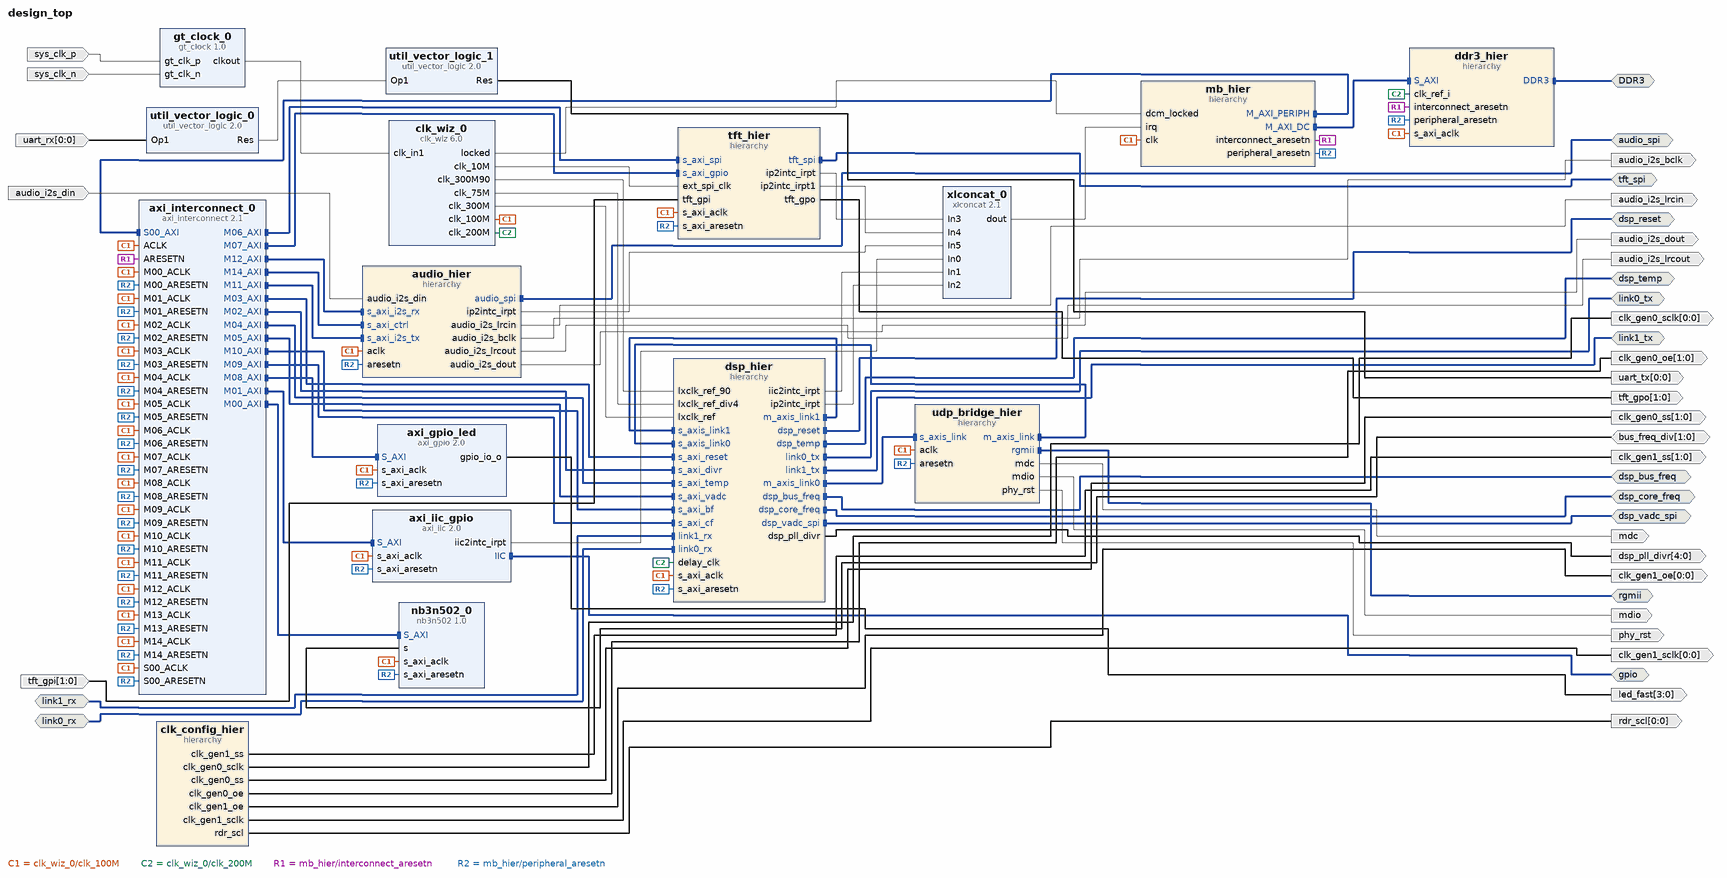
[diagram p0: block diagram of the top level]
# Vivado block design design_top, xc7a200tffg1156-2, Vivado 2018.3
create_bd_design design_top

create_bd_intf_port -mode Master -vlnv xilinx.com:interface:ddrx_rtl:1.0 DDR3
create_bd_intf_port -mode Master -vlnv xilinx.com:interface:iic_rtl:1.0 gpio
create_bd_intf_port -mode Master -vlnv xilinx.com:interface:iic_rtl:1.0 dsp_temp
create_bd_intf_port -mode Master -vlnv xilinx.com:interface:spi_rtl:1.0 tft_spi
create_bd_intf_port -mode Master -vlnv xilinx.com:interface:spi_rtl:1.0 dsp_vadc_spi
create_bd_intf_port -mode Master -vlnv xilinx.com:interface:gpio_rtl:1.0 dsp_reset
create_bd_intf_port -mode Slave -vlnv milandr.ru:interface:link_io_rtl:1.0 link0_rx
create_bd_intf_port -mode Slave -vlnv milandr.ru:interface:link_io_rtl:1.0 link1_rx
create_bd_intf_port -mode Master -vlnv milandr.ru:interface:link_io_rtl:1.0 link0_tx
create_bd_intf_port -mode Master -vlnv milandr.ru:interface:link_io_rtl:1.0 link1_tx
create_bd_intf_port -mode Master -vlnv xilinx.com:interface:gpio_rtl:1.0 dsp_core_freq
create_bd_intf_port -mode Master -vlnv xilinx.com:interface:gpio_rtl:1.0 dsp_bus_freq
create_bd_intf_port -mode Master -vlnv xilinx.com:interface:rgmii_rtl:1.0 rgmii
create_bd_intf_port -mode Master -vlnv xilinx.com:interface:spi_rtl:1.0 audio_spi
create_bd_port -dir O -from 3 -to 0 led_fast
create_bd_port -dir I -type clk sys_clk_p
create_bd_port -dir I -type clk sys_clk_n
create_bd_port -dir O -from 1 -to 0 clk_gen1_ss
create_bd_port -dir O -from 0 -to 0 clk_gen0_sclk
create_bd_port -dir O -from 1 -to 0 clk_gen0_ss
create_bd_port -dir O -from 1 -to 0 clk_gen0_oe
create_bd_port -dir O -from 0 -to 0 clk_gen1_oe
create_bd_port -dir O -from 0 -to 0 clk_gen1_sclk
create_bd_port -dir O -from 0 -to 0 rdr_scl
create_bd_port -dir IO -from 1 -to 0 bus_freq_div
create_bd_port -dir O -from 4 -to 0 dsp_pll_divr
create_bd_port -dir I -from 0 -to 0 uart_rx
create_bd_port -dir O -from 0 -to 0 uart_tx
create_bd_port -dir I -from 1 -to 0 tft_gpi
create_bd_port -dir O -from 1 -to 0 tft_gpo
create_bd_port -dir O mdc
create_bd_port -dir O mdio
create_bd_port -dir O -type rst phy_rst
create_bd_port -dir O audio_i2s_lrcin
create_bd_port -dir O audio_i2s_lrcout
create_bd_port -dir O audio_i2s_bclk
create_bd_port -dir O audio_i2s_dout
create_bd_port -dir I audio_i2s_din

create_bd_cell -type ip -vlnv xilinx.com:ip:clk_wiz:6.0 clk_wiz_0
set_property -dict [list \
  CONFIG.CLKOUT1_JITTER 115.831 \
  CONFIG.CLKOUT1_PHASE_ERROR 87.180 \
  CONFIG.CLKOUT2_JITTER 102.086 \
  CONFIG.CLKOUT2_PHASE_ERROR 87.180 \
  CONFIG.CLKOUT2_REQUESTED_OUT_FREQ 200.000 \
  CONFIG.CLKOUT2_USED true \
  CONFIG.CLKOUT3_JITTER 94.862 \
  CONFIG.CLKOUT3_PHASE_ERROR 87.180 \
  CONFIG.CLKOUT3_REQUESTED_OUT_FREQ 300.000 \
  CONFIG.CLKOUT3_USED true \
  CONFIG.CLKOUT4_JITTER 94.862 \
  CONFIG.CLKOUT4_PHASE_ERROR 87.180 \
  CONFIG.CLKOUT4_REQUESTED_OUT_FREQ 300.000 \
  CONFIG.CLKOUT4_REQUESTED_PHASE -90 \
  CONFIG.CLKOUT4_USED true \
  CONFIG.CLKOUT5_JITTER 122.158 \
  CONFIG.CLKOUT5_PHASE_ERROR 87.180 \
  CONFIG.CLKOUT5_REQUESTED_OUT_FREQ 75.000 \
  CONFIG.CLKOUT5_USED true \
  CONFIG.CLKOUT6_JITTER 188.586 \
  CONFIG.CLKOUT6_PHASE_ERROR 87.180 \
  CONFIG.CLKOUT6_REQUESTED_OUT_FREQ 10.000 \
  CONFIG.CLKOUT6_USED true \
  CONFIG.CLKOUT7_JITTER 115.831 \
  CONFIG.CLKOUT7_PHASE_ERROR 87.180 \
  CONFIG.CLKOUT7_REQUESTED_OUT_FREQ 10 \
  CONFIG.CLKOUT7_USED false \
  CONFIG.CLK_OUT1_PORT clk_100M \
  CONFIG.CLK_OUT2_PORT clk_200M \
  CONFIG.CLK_OUT3_PORT clk_300M \
  CONFIG.CLK_OUT4_PORT clk_300M90 \
  CONFIG.CLK_OUT5_PORT clk_75M \
  CONFIG.CLK_OUT6_PORT clk_10M \
  CONFIG.CLK_OUT7_PORT clk_10M \
  CONFIG.MMCM_CLKFBOUT_MULT_F 12.000 \
  CONFIG.MMCM_CLKOUT0_DIVIDE_F 12.000 \
  CONFIG.MMCM_CLKOUT1_DIVIDE 6 \
  CONFIG.MMCM_CLKOUT2_DIVIDE 4 \
  CONFIG.MMCM_CLKOUT3_DIVIDE 4 \
  CONFIG.MMCM_CLKOUT3_PHASE -90.000 \
  CONFIG.MMCM_CLKOUT4_DIVIDE 16 \
  CONFIG.MMCM_CLKOUT5_DIVIDE 120 \
  CONFIG.MMCM_CLKOUT6_DIVIDE 1 \
  CONFIG.MMCM_DIVCLK_DIVIDE 1 \
  CONFIG.NUM_OUT_CLKS 6 \
  CONFIG.PRIM_IN_FREQ 100.000 \
  CONFIG.PRIM_SOURCE Global_buffer \
  CONFIG.USE_RESET false \
] [get_bd_cells clk_wiz_0]
create_bd_cell -type hier ddr3_hier
create_bd_cell -type hier mb_hier
create_bd_cell -type ip -vlnv xilinx.com:ip:axi_interconnect:2.1 axi_interconnect_0
set_property -dict {CONFIG.NUM_MI 15} [get_bd_cells axi_interconnect_0]
create_bd_cell -type ip -vlnv xilinx.com:ip:axi_iic:2.0 axi_iic_gpio
create_bd_cell -type ip -vlnv xilinx.com:ip:xlconcat:2.1 xlconcat_0
set_property -dict {CONFIG.NUM_PORTS 6} [get_bd_cells xlconcat_0]
create_bd_cell -type ip -vlnv xilinx.com:ip:util_vector_logic:2.0 util_vector_logic_0
set_property -dict {CONFIG.C_OPERATION not CONFIG.C_SIZE 1} [get_bd_cells util_vector_logic_0]
create_bd_cell -type ip -vlnv xilinx.com:ip:util_vector_logic:2.0 util_vector_logic_1
set_property -dict {CONFIG.C_OPERATION not CONFIG.C_SIZE 1} [get_bd_cells util_vector_logic_1]
create_bd_cell -type ip -vlnv xilinx.com:ip:axi_gpio:2.0 axi_gpio_led
set_property -dict {CONFIG.C_ALL_OUTPUTS 1 CONFIG.C_GPIO_WIDTH 4} [get_bd_cells axi_gpio_led]
create_bd_cell -type hier clk_config_hier
create_bd_cell -type hier dsp_hier
create_bd_cell -type hier tft_hier
create_bd_cell -type hier udp_bridge_hier
create_bd_cell -type hier audio_hier
create_bd_cell -type ip -vlnv milandr.ru:ip:gt_clock:1.0 gt_clock_0
create_bd_cell -type ip -vlnv milandr.ru:ip:nb3n502:1.0 nb3n502_0

# ---- hierarchy /ddr3_hier ----
current_bd_instance /ddr3_hier
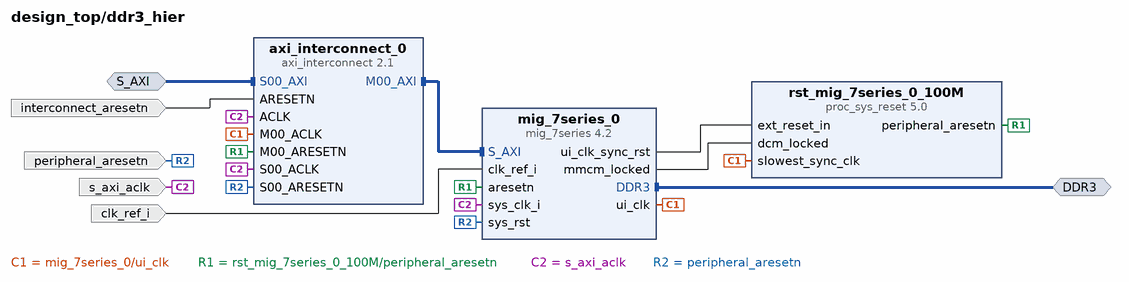
[diagram p1: block diagram inside /ddr3_hier]
create_bd_intf_pin -mode Master -vlnv xilinx.com:interface:ddrx_rtl:1.0 DDR3
create_bd_intf_pin -mode Slave -vlnv xilinx.com:interface:aximm_rtl:1.0 S_AXI
create_bd_pin -dir I -type rst interconnect_aresetn
create_bd_pin -dir I -type clk clk_ref_i
create_bd_pin -dir I -type clk s_axi_aclk
create_bd_pin -dir I -type rst peripheral_aresetn

create_bd_cell -type ip -vlnv xilinx.com:ip:mig_7series:4.2 mig_7series_0
set_property -dict [list \
  CONFIG.BOARD_MIG_PARAM Custom \
  CONFIG.RESET_BOARD_INTERFACE Custom \
  CONFIG.XML_INPUT_FILE mig_a.prj \
] [get_bd_cells mig_7series_0]
create_bd_cell -type ip -vlnv xilinx.com:ip:proc_sys_reset:5.0 rst_mig_7series_0_100M
create_bd_cell -type ip -vlnv xilinx.com:ip:axi_interconnect:2.1 axi_interconnect_0
set_property -dict {CONFIG.NUM_MI 1 CONFIG.NUM_SI 1} [get_bd_cells axi_interconnect_0]

# ---- hierarchy /mb_hier ----
current_bd_instance /mb_hier
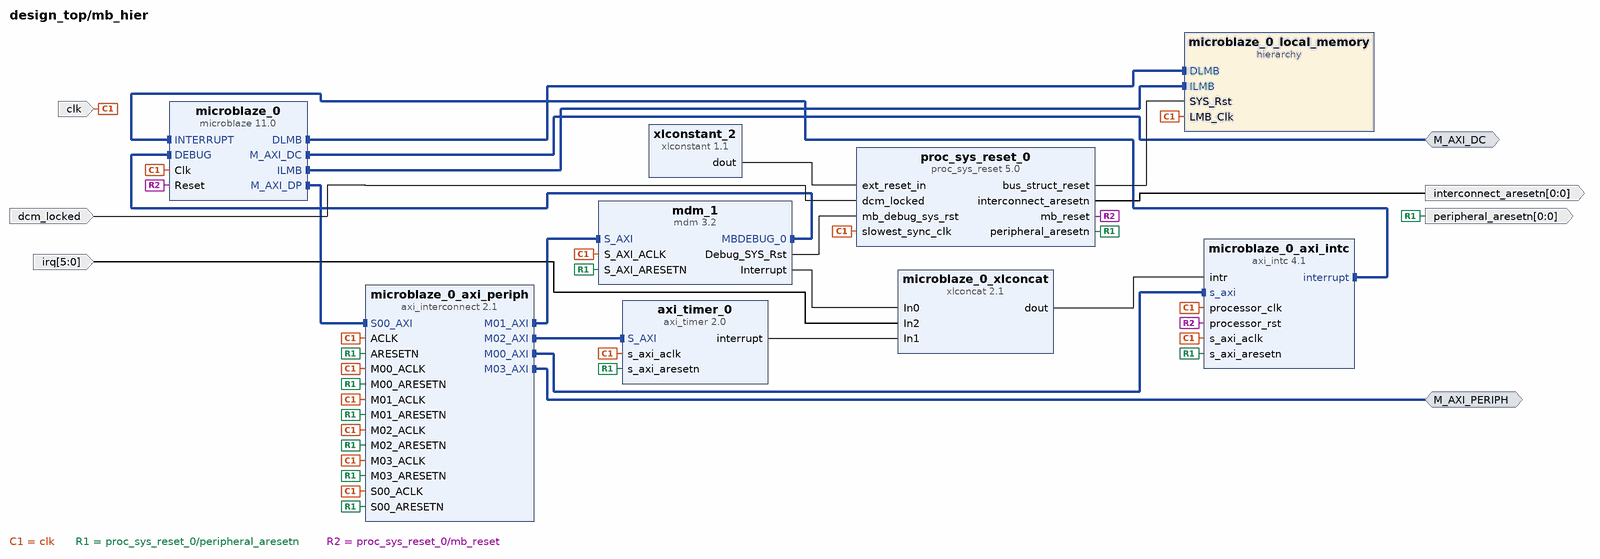
[diagram p2: block diagram inside /mb_hier]
create_bd_intf_pin -mode Master -vlnv xilinx.com:interface:aximm_rtl:1.0 M_AXI_DC
create_bd_intf_pin -mode Master -vlnv xilinx.com:interface:aximm_rtl:1.0 M_AXI_PERIPH
create_bd_pin -dir I -type clk clk
create_bd_pin -dir I dcm_locked
create_bd_pin -dir O -from 0 -to 0 -type rst interconnect_aresetn
create_bd_pin -dir O -from 0 -to 0 -type rst peripheral_aresetn
create_bd_pin -dir I -from 5 -to 0 irq

create_bd_cell -type ip -vlnv xilinx.com:ip:mdm:3.2 mdm_1
set_property -dict {CONFIG.C_ADDR_SIZE 32 CONFIG.C_M_AXI_ADDR_WIDTH 32 CONFIG.C_USE_UART 1} [get_bd_cells mdm_1]
create_bd_cell -type ip -vlnv xilinx.com:ip:axi_intc:4.1 microblaze_0_axi_intc
set_property -dict {CONFIG.C_HAS_FAST 1} [get_bd_cells microblaze_0_axi_intc]
create_bd_cell -type ip -vlnv xilinx.com:ip:axi_timer:2.0 axi_timer_0
create_bd_cell -type ip -vlnv xilinx.com:ip:xlconcat:2.1 microblaze_0_xlconcat
set_property -dict {CONFIG.NUM_PORTS 3} [get_bd_cells microblaze_0_xlconcat]
create_bd_cell -type ip -vlnv xilinx.com:ip:microblaze:11.0 microblaze_0
set_property -dict [list \
  CONFIG.C_ADDR_TAG_BITS 0 \
  CONFIG.C_DCACHE_ADDR_TAG 16 \
  CONFIG.C_DCACHE_FORCE_TAG_LUTRAM 0 \
  CONFIG.C_DCACHE_USE_WRITEBACK 0 \
  CONFIG.C_DEBUG_ENABLED 1 \
  CONFIG.C_D_AXI 1 \
  CONFIG.C_D_LMB 1 \
  CONFIG.C_I_LMB 1 \
  CONFIG.C_USE_BARREL 1 \
  CONFIG.C_USE_DCACHE 1 \
  CONFIG.C_USE_DIV 1 \
  CONFIG.C_USE_FPU 1 \
  CONFIG.C_USE_HW_MUL 1 \
  CONFIG.C_USE_ICACHE 0 \
  CONFIG.C_USE_MSR_INSTR 1 \
  CONFIG.C_USE_PCMP_INSTR 1 \
  CONFIG.C_USE_REORDER_INSTR 1 \
] [get_bd_cells microblaze_0]
create_bd_cell -type hier microblaze_0_local_memory
create_bd_cell -type ip -vlnv xilinx.com:ip:axi_interconnect:2.1 microblaze_0_axi_periph
set_property -dict {CONFIG.NUM_MI 4} [get_bd_cells microblaze_0_axi_periph]
create_bd_cell -type ip -vlnv xilinx.com:ip:proc_sys_reset:5.0 proc_sys_reset_0
create_bd_cell -type ip -vlnv xilinx.com:ip:xlconstant:1.1 xlconstant_2

# ---- hierarchy /mb_hier/microblaze_0_local_memory ----
current_bd_instance /mb_hier/microblaze_0_local_memory
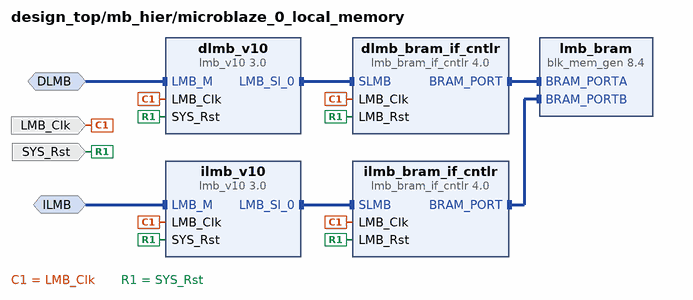
[diagram p3: block diagram inside /mb_hier/microblaze_0_local_memory]
create_bd_intf_pin -mode MirroredMaster -vlnv xilinx.com:interface:lmb_rtl:1.0 DLMB
create_bd_intf_pin -mode MirroredMaster -vlnv xilinx.com:interface:lmb_rtl:1.0 ILMB
create_bd_pin -dir I -type clk LMB_Clk
create_bd_pin -dir I -type rst SYS_Rst

create_bd_cell -type ip -vlnv xilinx.com:ip:lmb_v10:3.0 dlmb_v10
create_bd_cell -type ip -vlnv xilinx.com:ip:lmb_v10:3.0 ilmb_v10
create_bd_cell -type ip -vlnv xilinx.com:ip:lmb_bram_if_cntlr:4.0 dlmb_bram_if_cntlr
set_property -dict {CONFIG.C_ECC 0} [get_bd_cells dlmb_bram_if_cntlr]
create_bd_cell -type ip -vlnv xilinx.com:ip:lmb_bram_if_cntlr:4.0 ilmb_bram_if_cntlr
set_property -dict {CONFIG.C_ECC 0} [get_bd_cells ilmb_bram_if_cntlr]
create_bd_cell -type ip -vlnv xilinx.com:ip:blk_mem_gen:8.4 lmb_bram
set_property -dict {CONFIG.Memory_Type True_Dual_Port_RAM CONFIG.use_bram_block BRAM_Controller} [get_bd_cells lmb_bram]

# ---- hierarchy /clk_config_hier ----
current_bd_instance /clk_config_hier
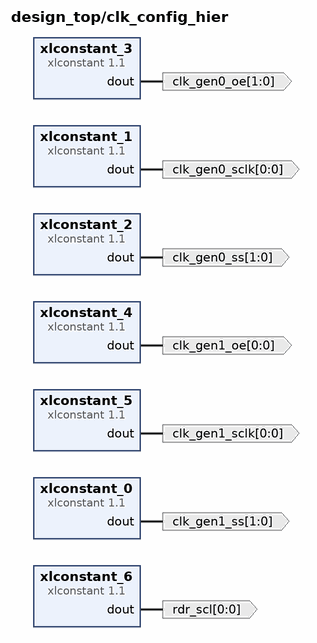
[diagram p4: block diagram inside /clk_config_hier]
create_bd_pin -dir O -from 1 -to 0 clk_gen1_ss
create_bd_pin -dir O -from 0 -to 0 clk_gen0_sclk
create_bd_pin -dir O -from 1 -to 0 clk_gen0_ss
create_bd_pin -dir O -from 1 -to 0 clk_gen0_oe
create_bd_pin -dir O -from 0 -to 0 clk_gen1_oe
create_bd_pin -dir O -from 0 -to 0 clk_gen1_sclk
create_bd_pin -dir O -from 0 -to 0 rdr_scl

create_bd_cell -type ip -vlnv xilinx.com:ip:xlconstant:1.1 xlconstant_0
set_property -dict {CONFIG.CONST_VAL 0 CONFIG.CONST_WIDTH 2} [get_bd_cells xlconstant_0]
create_bd_cell -type ip -vlnv xilinx.com:ip:xlconstant:1.1 xlconstant_1
set_property -dict {CONFIG.CONST_VAL 0 CONFIG.CONST_WIDTH 1} [get_bd_cells xlconstant_1]
create_bd_cell -type ip -vlnv xilinx.com:ip:xlconstant:1.1 xlconstant_2
set_property -dict {CONFIG.CONST_VAL 0 CONFIG.CONST_WIDTH 2} [get_bd_cells xlconstant_2]
create_bd_cell -type ip -vlnv xilinx.com:ip:xlconstant:1.1 xlconstant_3
set_property -dict {CONFIG.CONST_VAL 1 CONFIG.CONST_WIDTH 2} [get_bd_cells xlconstant_3]
create_bd_cell -type ip -vlnv xilinx.com:ip:xlconstant:1.1 xlconstant_4
set_property -dict {CONFIG.CONST_VAL 1 CONFIG.CONST_WIDTH 1} [get_bd_cells xlconstant_4]
create_bd_cell -type ip -vlnv xilinx.com:ip:xlconstant:1.1 xlconstant_5
set_property -dict {CONFIG.CONST_VAL 0 CONFIG.CONST_WIDTH 1} [get_bd_cells xlconstant_5]
create_bd_cell -type ip -vlnv xilinx.com:ip:xlconstant:1.1 xlconstant_6
set_property -dict {CONFIG.CONST_VAL 0 CONFIG.CONST_WIDTH 1} [get_bd_cells xlconstant_6]

# ---- hierarchy /dsp_hier ----
current_bd_instance /dsp_hier
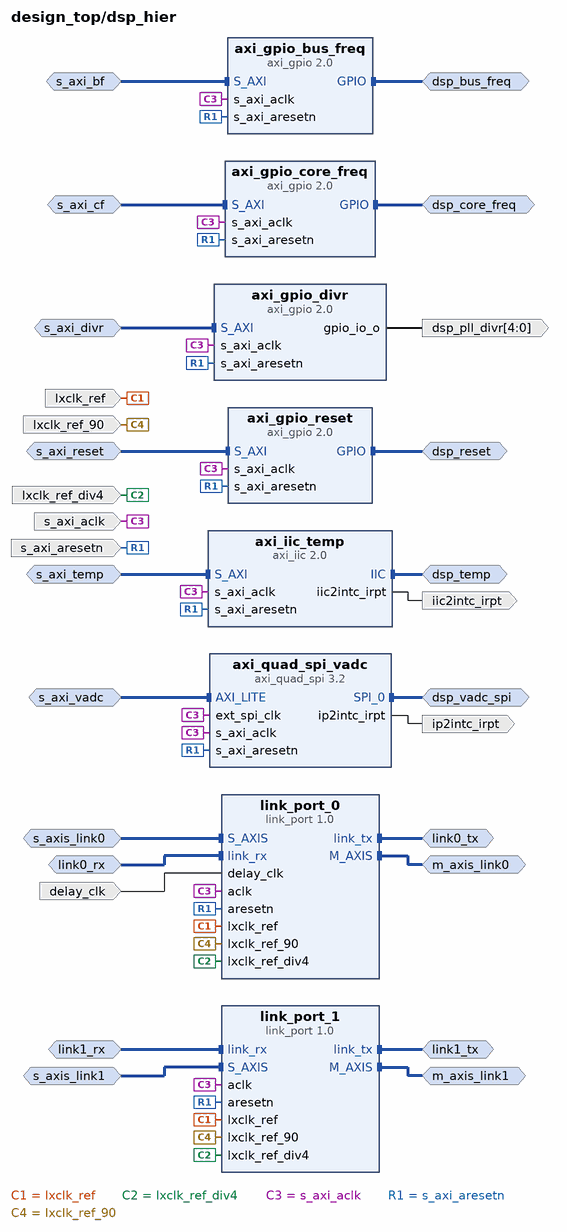
[diagram p5: block diagram inside /dsp_hier]
create_bd_intf_pin -mode Slave -vlnv milandr.ru:interface:link_io_rtl:1.0 link0_rx
create_bd_intf_pin -mode Master -vlnv milandr.ru:interface:link_io_rtl:1.0 link0_tx
create_bd_intf_pin -mode Slave -vlnv xilinx.com:interface:aximm_rtl:1.0 s_axi_temp
create_bd_intf_pin -mode Master -vlnv xilinx.com:interface:iic_rtl:1.0 dsp_temp
create_bd_intf_pin -mode Slave -vlnv xilinx.com:interface:aximm_rtl:1.0 s_axi_divr
create_bd_intf_pin -mode Slave -vlnv xilinx.com:interface:aximm_rtl:1.0 s_axi_reset
create_bd_intf_pin -mode Master -vlnv xilinx.com:interface:gpio_rtl:1.0 dsp_reset
create_bd_intf_pin -mode Master -vlnv xilinx.com:interface:spi_rtl:1.0 dsp_vadc_spi
create_bd_intf_pin -mode Slave -vlnv xilinx.com:interface:aximm_rtl:1.0 s_axi_vadc
create_bd_intf_pin -mode Slave -vlnv milandr.ru:interface:link_io_rtl:1.0 link1_rx
create_bd_intf_pin -mode Master -vlnv milandr.ru:interface:link_io_rtl:1.0 link1_tx
create_bd_intf_pin -mode Slave -vlnv xilinx.com:interface:aximm_rtl:1.0 s_axi_cf
create_bd_intf_pin -mode Slave -vlnv xilinx.com:interface:aximm_rtl:1.0 s_axi_bf
create_bd_intf_pin -mode Master -vlnv xilinx.com:interface:gpio_rtl:1.0 dsp_core_freq
create_bd_intf_pin -mode Master -vlnv xilinx.com:interface:gpio_rtl:1.0 dsp_bus_freq
create_bd_intf_pin -mode Slave -vlnv xilinx.com:interface:axis_rtl:1.0 s_axis_link0
create_bd_intf_pin -mode Master -vlnv xilinx.com:interface:axis_rtl:1.0 m_axis_link0
create_bd_intf_pin -mode Slave -vlnv xilinx.com:interface:axis_rtl:1.0 s_axis_link1
create_bd_intf_pin -mode Master -vlnv xilinx.com:interface:axis_rtl:1.0 m_axis_link1
create_bd_pin -dir I lxclk_ref
create_bd_pin -dir I lxclk_ref_div4
create_bd_pin -dir I delay_clk
create_bd_pin -dir I -type clk s_axi_aclk
create_bd_pin -dir I -type rst s_axi_aresetn
create_bd_pin -dir I lxclk_ref_90
create_bd_pin -dir O -type intr iic2intc_irpt
create_bd_pin -dir O -from 4 -to 0 dsp_pll_divr
create_bd_pin -dir O -type intr ip2intc_irpt

create_bd_cell -type ip -vlnv xilinx.com:ip:axi_iic:2.0 axi_iic_temp
create_bd_cell -type ip -vlnv xilinx.com:ip:axi_gpio:2.0 axi_gpio_divr
set_property -dict {CONFIG.C_ALL_OUTPUTS 1 CONFIG.C_GPIO_WIDTH 5} [get_bd_cells axi_gpio_divr]
create_bd_cell -type ip -vlnv xilinx.com:ip:axi_gpio:2.0 axi_gpio_reset
set_property -dict {CONFIG.C_ALL_OUTPUTS 0 CONFIG.C_GPIO_WIDTH 1 CONFIG.C_TRI_DEFAULT 0x00000000} [get_bd_cells axi_gpio_reset]
create_bd_cell -type ip -vlnv xilinx.com:ip:axi_quad_spi:3.2 axi_quad_spi_vadc
set_property -dict [list \
  CONFIG.C_NUM_SS_BITS 3 \
  CONFIG.C_NUM_TRANSFER_BITS 16 \
  CONFIG.C_USE_STARTUP 0 \
  CONFIG.Multiples16 64 \
] [get_bd_cells axi_quad_spi_vadc]
create_bd_cell -type ip -vlnv xilinx.com:ip:axi_gpio:2.0 axi_gpio_core_freq
set_property -dict {CONFIG.C_ALL_INPUTS 1 CONFIG.C_GPIO_WIDTH 2} [get_bd_cells axi_gpio_core_freq]
create_bd_cell -type ip -vlnv xilinx.com:ip:axi_gpio:2.0 axi_gpio_bus_freq
set_property -dict {CONFIG.C_ALL_INPUTS 1 CONFIG.C_GPIO_WIDTH 2} [get_bd_cells axi_gpio_bus_freq]
create_bd_cell -type ip -vlnv milandr.ru:ip:link_port:1.0 link_port_0
set_property -dict [list \
  CONFIG.BCMP_RX_USE true \
  CONFIG.BCMP_TX_USE true \
  CONFIG.DELAY_CTRL_INST true \
  CONFIG.DELAY_GROUP LINK_GROUP_0 \
] [get_bd_cells link_port_0]
create_bd_cell -type ip -vlnv milandr.ru:ip:link_port:1.0 link_port_1
set_property -dict [list \
  CONFIG.BCMP_RX_USE true \
  CONFIG.BCMP_TX_USE true \
  CONFIG.DELAY_CTRL_INST false \
  CONFIG.DELAY_GROUP LINK_GROUP_0 \
] [get_bd_cells link_port_1]

# ---- hierarchy /tft_hier ----
current_bd_instance /tft_hier
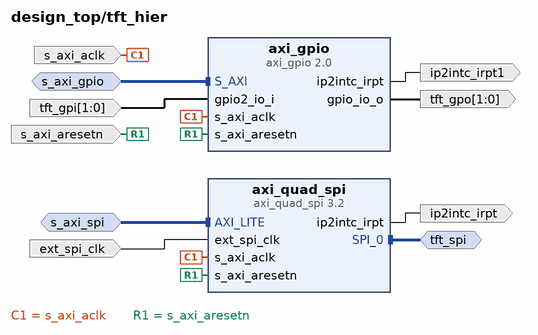
[diagram p6: block diagram inside /tft_hier]
create_bd_intf_pin -mode Master -vlnv xilinx.com:interface:spi_rtl:1.0 tft_spi
create_bd_intf_pin -mode Slave -vlnv xilinx.com:interface:aximm_rtl:1.0 s_axi_spi
create_bd_intf_pin -mode Slave -vlnv xilinx.com:interface:aximm_rtl:1.0 s_axi_gpio
create_bd_pin -dir I -type clk ext_spi_clk
create_bd_pin -dir I -type clk s_axi_aclk
create_bd_pin -dir I -type rst s_axi_aresetn
create_bd_pin -dir O -type intr ip2intc_irpt
create_bd_pin -dir O -type intr ip2intc_irpt1
create_bd_pin -dir O -from 1 -to 0 tft_gpo
create_bd_pin -dir I -from 1 -to 0 tft_gpi

create_bd_cell -type ip -vlnv xilinx.com:ip:axi_quad_spi:3.2 axi_quad_spi
set_property -dict {CONFIG.C_NUM_SS_BITS 3 CONFIG.C_SCK_RATIO 2 CONFIG.C_USE_STARTUP 0} [get_bd_cells axi_quad_spi]
create_bd_cell -type ip -vlnv xilinx.com:ip:axi_gpio:2.0 axi_gpio
set_property -dict [list \
  CONFIG.C_ALL_INPUTS 0 \
  CONFIG.C_ALL_INPUTS_2 1 \
  CONFIG.C_ALL_OUTPUTS 1 \
  CONFIG.C_DOUT_DEFAULT 0x00000000 \
  CONFIG.C_GPIO2_WIDTH 2 \
  CONFIG.C_GPIO_WIDTH 2 \
  CONFIG.C_INTERRUPT_PRESENT 1 \
  CONFIG.C_IS_DUAL 1 \
] [get_bd_cells axi_gpio]

# ---- hierarchy /udp_bridge_hier ----
current_bd_instance /udp_bridge_hier
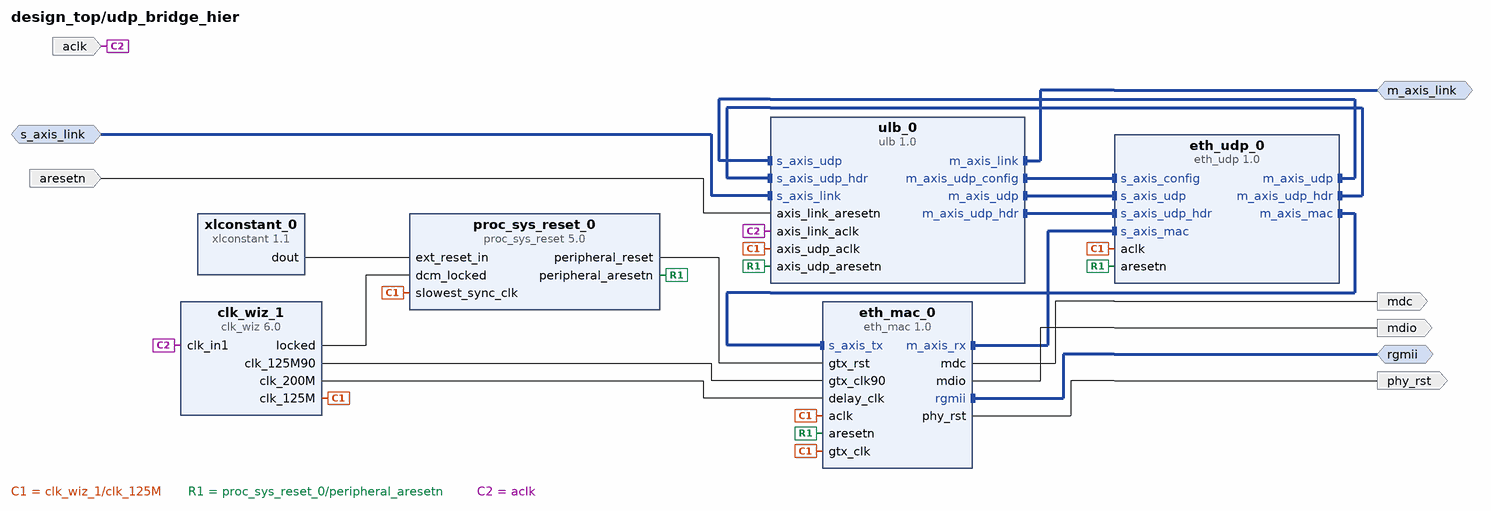
[diagram p7: block diagram inside /udp_bridge_hier]
create_bd_intf_pin -mode Master -vlnv xilinx.com:interface:rgmii_rtl:1.0 rgmii
create_bd_intf_pin -mode Master -vlnv xilinx.com:interface:axis_rtl:1.0 m_axis_link
create_bd_intf_pin -mode Slave -vlnv xilinx.com:interface:axis_rtl:1.0 s_axis_link
create_bd_pin -dir I -type clk aclk
create_bd_pin -dir O mdc
create_bd_pin -dir O mdio
create_bd_pin -dir O -type rst phy_rst
create_bd_pin -dir I -type rst aresetn

create_bd_cell -type ip -vlnv xilinx.com:ip:clk_wiz:6.0 clk_wiz_1
set_property -dict [list \
  CONFIG.CLKOUT1_JITTER 125.247 \
  CONFIG.CLKOUT1_REQUESTED_OUT_FREQ 125 \
  CONFIG.CLKOUT2_JITTER 125.247 \
  CONFIG.CLKOUT2_PHASE_ERROR 98.575 \
  CONFIG.CLKOUT2_REQUESTED_OUT_FREQ 125 \
  CONFIG.CLKOUT2_REQUESTED_PHASE 90 \
  CONFIG.CLKOUT2_USED true \
  CONFIG.CLKOUT3_JITTER 114.829 \
  CONFIG.CLKOUT3_PHASE_ERROR 98.575 \
  CONFIG.CLKOUT3_REQUESTED_OUT_FREQ 200 \
  CONFIG.CLKOUT3_USED true \
  CONFIG.CLK_OUT1_PORT clk_125M \
  CONFIG.CLK_OUT2_PORT clk_125M90 \
  CONFIG.CLK_OUT3_PORT clk_200M \
  CONFIG.MMCM_CLKOUT0_DIVIDE_F 8.000 \
  CONFIG.MMCM_CLKOUT1_DIVIDE 8 \
  CONFIG.MMCM_CLKOUT1_PHASE 90.000 \
  CONFIG.MMCM_CLKOUT2_DIVIDE 5 \
  CONFIG.MMCM_DIVCLK_DIVIDE 1 \
  CONFIG.NUM_OUT_CLKS 3 \
  CONFIG.PRIM_IN_FREQ 100.000 \
  CONFIG.PRIM_SOURCE Global_buffer \
  CONFIG.USE_RESET false \
] [get_bd_cells clk_wiz_1]
create_bd_cell -type ip -vlnv xilinx.com:ip:xlconstant:1.1 xlconstant_0
create_bd_cell -type ip -vlnv xilinx.com:ip:proc_sys_reset:5.0 proc_sys_reset_0
create_bd_cell -type ip -vlnv milandr.ru:ip:eth_mac:1.0 eth_mac_0
set_property -dict {CONFIG.USE_DELAY_CTRL 1} [get_bd_cells eth_mac_0]
create_bd_cell -type ip -vlnv milandr.ru:ip:eth_udp:1.0 eth_udp_0
create_bd_cell -type ip -vlnv milandr.ru:ip:ulb:1.0 ulb_0
set_property -dict {CONFIG.CONFIG_ENABLE 0 CONFIG.DEST_PORT 1234 CONFIG.SOURCE_PORT 1234} [get_bd_cells ulb_0]

# ---- hierarchy /audio_hier ----
current_bd_instance /audio_hier
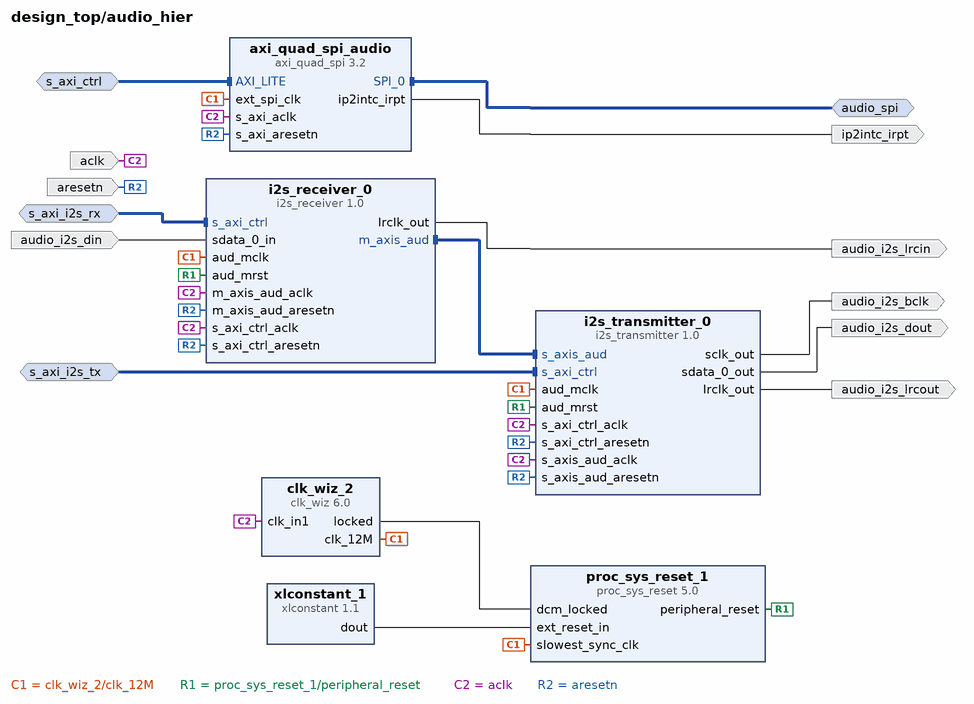
[diagram p8: block diagram inside /audio_hier]
create_bd_intf_pin -mode Slave -vlnv xilinx.com:interface:aximm_rtl:1.0 s_axi_i2s_rx
create_bd_intf_pin -mode Slave -vlnv xilinx.com:interface:aximm_rtl:1.0 s_axi_i2s_tx
create_bd_intf_pin -mode Master -vlnv xilinx.com:interface:spi_rtl:1.0 audio_spi
create_bd_intf_pin -mode Slave -vlnv xilinx.com:interface:aximm_rtl:1.0 s_axi_ctrl
create_bd_pin -dir I -type clk aclk
create_bd_pin -dir I -type rst aresetn
create_bd_pin -dir O audio_i2s_lrcin
create_bd_pin -dir I audio_i2s_din
create_bd_pin -dir O audio_i2s_lrcout
create_bd_pin -dir O audio_i2s_bclk
create_bd_pin -dir O audio_i2s_dout
create_bd_pin -dir O -type intr ip2intc_irpt

create_bd_cell -type ip -vlnv xilinx.com:ip:clk_wiz:6.0 clk_wiz_2
set_property -dict [list \
  CONFIG.CLKOUT1_JITTER 345.775 \
  CONFIG.CLKOUT1_PHASE_ERROR 293.793 \
  CONFIG.CLKOUT1_REQUESTED_OUT_FREQ 12 \
  CONFIG.CLK_OUT1_PORT clk_12M \
  CONFIG.MMCM_CLKFBOUT_MULT_F 49.875 \
  CONFIG.MMCM_CLKOUT0_DIVIDE_F 83.125 \
  CONFIG.MMCM_DIVCLK_DIVIDE 5 \
  CONFIG.USE_RESET false \
] [get_bd_cells clk_wiz_2]
create_bd_cell -type ip -vlnv xilinx.com:ip:xlconstant:1.1 xlconstant_1
create_bd_cell -type ip -vlnv xilinx.com:ip:i2s_receiver:1.0 i2s_receiver_0
set_property -dict {CONFIG.C_DWIDTH 16} [get_bd_cells i2s_receiver_0]
create_bd_cell -type ip -vlnv xilinx.com:ip:proc_sys_reset:5.0 proc_sys_reset_1
create_bd_cell -type ip -vlnv xilinx.com:ip:i2s_transmitter:1.0 i2s_transmitter_0
set_property -dict {CONFIG.C_DWIDTH 16} [get_bd_cells i2s_transmitter_0]
create_bd_cell -type ip -vlnv xilinx.com:ip:axi_quad_spi:3.2 axi_quad_spi_audio
set_property -dict {CONFIG.C_NUM_TRANSFER_BITS 16 CONFIG.C_SCK_RATIO 4 CONFIG.C_USE_STARTUP 0} [get_bd_cells axi_quad_spi_audio]

# ---- connections ----

current_bd_instance /ddr3_hier
connect_bd_intf_net [get_bd_intf_pins S_AXI] [get_bd_intf_pins axi_interconnect_0/S00_AXI]
connect_bd_intf_net [get_bd_intf_pins axi_interconnect_0/M00_AXI] [get_bd_intf_pins mig_7series_0/S_AXI]
connect_bd_intf_net [get_bd_intf_pins DDR3] [get_bd_intf_pins mig_7series_0/DDR3]
connect_bd_net [get_bd_pins mig_7series_0/ui_clk_sync_rst] [get_bd_pins rst_mig_7series_0_100M/ext_reset_in]
connect_bd_net [get_bd_pins mig_7series_0/ui_clk] [get_bd_pins rst_mig_7series_0_100M/slowest_sync_clk] [get_bd_pins axi_interconnect_0/M00_ACLK]
connect_bd_net [get_bd_pins mig_7series_0/mmcm_locked] [get_bd_pins rst_mig_7series_0_100M/dcm_locked]
connect_bd_net [get_bd_pins rst_mig_7series_0_100M/peripheral_aresetn] \
  [get_bd_pins mig_7series_0/aresetn] [get_bd_pins axi_interconnect_0/M00_ARESETN]
connect_bd_net -net clk_wiz_0_clk_200M [get_bd_pins clk_ref_i] [get_bd_pins mig_7series_0/clk_ref_i]
connect_bd_net -net microblaze_0_Clk [get_bd_pins s_axi_aclk] \
  [get_bd_pins mig_7series_0/sys_clk_i] [get_bd_pins axi_interconnect_0/ACLK] [get_bd_pins axi_interconnect_0/S00_ACLK]
connect_bd_net -net S00_ARESETN_1 [get_bd_pins peripheral_aresetn] [get_bd_pins axi_interconnect_0/S00_ARESETN] [get_bd_pins mig_7series_0/sys_rst]
connect_bd_net -net s_axi_aresetn_1 [get_bd_pins interconnect_aresetn] [get_bd_pins axi_interconnect_0/ARESETN]

current_bd_instance /mb_hier
connect_bd_intf_net [get_bd_intf_pins microblaze_0_axi_intc/interrupt] [get_bd_intf_pins microblaze_0/INTERRUPT]
connect_bd_intf_net -intf_net microblaze_0_intc_axi [get_bd_intf_pins microblaze_0_axi_periph/M00_AXI] [get_bd_intf_pins microblaze_0_axi_intc/s_axi]
connect_bd_intf_net -intf_net microblaze_0_mdm_axi [get_bd_intf_pins microblaze_0_axi_periph/M01_AXI] [get_bd_intf_pins mdm_1/S_AXI]
connect_bd_intf_net -intf_net microblaze_0_axi_dp [get_bd_intf_pins microblaze_0_axi_periph/S00_AXI] [get_bd_intf_pins microblaze_0/M_AXI_DP]
connect_bd_intf_net [get_bd_intf_pins M_AXI_DC] [get_bd_intf_pins microblaze_0/M_AXI_DC]
connect_bd_intf_net [get_bd_intf_pins mdm_1/MBDEBUG_0] [get_bd_intf_pins microblaze_0/DEBUG]
connect_bd_intf_net [get_bd_intf_pins microblaze_0/DLMB] [get_bd_intf_pins microblaze_0_local_memory/DLMB]
connect_bd_intf_net [get_bd_intf_pins microblaze_0/ILMB] [get_bd_intf_pins microblaze_0_local_memory/ILMB]
connect_bd_intf_net [get_bd_intf_pins microblaze_0_axi_periph/M02_AXI] [get_bd_intf_pins axi_timer_0/S_AXI]
connect_bd_intf_net [get_bd_intf_pins M_AXI_PERIPH] [get_bd_intf_pins microblaze_0_axi_periph/M03_AXI]
connect_bd_net [get_bd_pins mdm_1/Interrupt] [get_bd_pins microblaze_0_xlconcat/In0]
connect_bd_net -net microblaze_0_intr [get_bd_pins microblaze_0_xlconcat/dout] [get_bd_pins microblaze_0_axi_intc/intr]
connect_bd_net [get_bd_pins axi_timer_0/interrupt] [get_bd_pins microblaze_0_xlconcat/In1]
connect_bd_net -net microblaze_0_Clk [get_bd_pins clk] \
  [get_bd_pins microblaze_0/Clk] [get_bd_pins microblaze_0_axi_periph/ACLK] [get_bd_pins microblaze_0_axi_periph/S00_ACLK] \
  [get_bd_pins microblaze_0_axi_periph/M00_ACLK] [get_bd_pins microblaze_0_axi_periph/M01_ACLK] \
  [get_bd_pins microblaze_0_axi_intc/s_axi_aclk] [get_bd_pins microblaze_0_axi_intc/processor_clk] \
  [get_bd_pins microblaze_0_local_memory/LMB_Clk] [get_bd_pins axi_timer_0/s_axi_aclk] \
  [get_bd_pins microblaze_0_axi_periph/M02_ACLK] [get_bd_pins mdm_1/S_AXI_ACLK] \
  [get_bd_pins proc_sys_reset_0/slowest_sync_clk] [get_bd_pins microblaze_0_axi_periph/M03_ACLK]
connect_bd_net [get_bd_pins proc_sys_reset_0/peripheral_aresetn] \
  [get_bd_pins microblaze_0_axi_periph/ARESETN] [get_bd_pins microblaze_0_axi_periph/S00_ARESETN] \
  [get_bd_pins microblaze_0_axi_periph/M00_ARESETN] [get_bd_pins microblaze_0_axi_periph/M01_ARESETN] \
  [get_bd_pins microblaze_0_axi_intc/s_axi_aresetn] [get_bd_pins axi_timer_0/s_axi_aresetn] \
  [get_bd_pins microblaze_0_axi_periph/M02_ARESETN] [get_bd_pins mdm_1/S_AXI_ARESETN] [get_bd_pins peripheral_aresetn] \
  [get_bd_pins microblaze_0_axi_periph/M03_ARESETN]
connect_bd_net [get_bd_pins proc_sys_reset_0/mb_reset] [get_bd_pins microblaze_0/Reset] [get_bd_pins microblaze_0_axi_intc/processor_rst]
connect_bd_net [get_bd_pins mdm_1/Debug_SYS_Rst] [get_bd_pins proc_sys_reset_0/mb_debug_sys_rst]
connect_bd_net -net SYS_Rst_1 [get_bd_pins proc_sys_reset_0/bus_struct_reset] [get_bd_pins microblaze_0_local_memory/SYS_Rst]
connect_bd_net [get_bd_pins dcm_locked] [get_bd_pins proc_sys_reset_0/dcm_locked]
connect_bd_net [get_bd_pins proc_sys_reset_0/interconnect_aresetn] [get_bd_pins interconnect_aresetn]
connect_bd_net [get_bd_pins xlconstant_2/dout] [get_bd_pins proc_sys_reset_0/ext_reset_in]
connect_bd_net -net In2_1 [get_bd_pins irq] [get_bd_pins microblaze_0_xlconcat/In2]
set_property HDL_ATTRIBUTE.BMM_INFO_PROCESSOR {microblaze-le > design_top mb_hier/microblaze_0_local_memory/dlmb_bram_if_cntlr} [get_bd_cells microblaze_0]
set_property HDL_ATTRIBUTE.KEEP_HIERARCHY yes [get_bd_cells microblaze_0]

current_bd_instance /mb_hier/microblaze_0_local_memory
connect_bd_intf_net -intf_net microblaze_0_dlmb_cntlr [get_bd_intf_pins dlmb_bram_if_cntlr/BRAM_PORT] [get_bd_intf_pins lmb_bram/BRAM_PORTA]
connect_bd_intf_net -intf_net microblaze_0_ilmb_bus [get_bd_intf_pins ilmb_v10/LMB_Sl_0] [get_bd_intf_pins ilmb_bram_if_cntlr/SLMB]
connect_bd_intf_net -intf_net microblaze_0_dlmb_bus [get_bd_intf_pins dlmb_v10/LMB_Sl_0] [get_bd_intf_pins dlmb_bram_if_cntlr/SLMB]
connect_bd_intf_net -intf_net microblaze_0_ilmb_cntlr [get_bd_intf_pins ilmb_bram_if_cntlr/BRAM_PORT] [get_bd_intf_pins lmb_bram/BRAM_PORTB]
connect_bd_intf_net -intf_net microblaze_0_ilmb [get_bd_intf_pins ILMB] [get_bd_intf_pins ilmb_v10/LMB_M]
connect_bd_intf_net -intf_net microblaze_0_dlmb [get_bd_intf_pins DLMB] [get_bd_intf_pins dlmb_v10/LMB_M]
connect_bd_net -net microblaze_0_Clk [get_bd_pins LMB_Clk] \
  [get_bd_pins dlmb_v10/LMB_Clk] [get_bd_pins dlmb_bram_if_cntlr/LMB_Clk] [get_bd_pins ilmb_v10/LMB_Clk] \
  [get_bd_pins ilmb_bram_if_cntlr/LMB_Clk]
connect_bd_net [get_bd_pins SYS_Rst] \
  [get_bd_pins dlmb_v10/SYS_Rst] [get_bd_pins dlmb_bram_if_cntlr/LMB_Rst] [get_bd_pins ilmb_v10/SYS_Rst] \
  [get_bd_pins ilmb_bram_if_cntlr/LMB_Rst]
set_property HDL_ATTRIBUTE.BMM_INFO_ADDRESS_SPACE {byte  0x00000000 32 > design_top mb_hier/microblaze_0_local_memory/lmb_bram} [get_bd_cells dlmb_bram_if_cntlr]
set_property HDL_ATTRIBUTE.KEEP_HIERARCHY yes [get_bd_cells dlmb_bram_if_cntlr]

current_bd_instance /clk_config_hier
connect_bd_net [get_bd_pins xlconstant_0/dout] [get_bd_pins clk_gen1_ss]
connect_bd_net [get_bd_pins xlconstant_1/dout] [get_bd_pins clk_gen0_sclk]
connect_bd_net [get_bd_pins xlconstant_2/dout] [get_bd_pins clk_gen0_ss]
connect_bd_net [get_bd_pins xlconstant_3/dout] [get_bd_pins clk_gen0_oe]
connect_bd_net [get_bd_pins xlconstant_4/dout] [get_bd_pins clk_gen1_oe]
connect_bd_net [get_bd_pins xlconstant_5/dout] [get_bd_pins clk_gen1_sclk]
connect_bd_net [get_bd_pins xlconstant_6/dout] [get_bd_pins rdr_scl]

current_bd_instance /dsp_hier
connect_bd_intf_net [get_bd_intf_pins s_axis_link0] [get_bd_intf_pins link_port_0/S_AXIS]
connect_bd_intf_net [get_bd_intf_pins dsp_core_freq] [get_bd_intf_pins axi_gpio_core_freq/GPIO]
connect_bd_intf_net -intf_net axi_iic_1_IIC [get_bd_intf_pins dsp_temp] [get_bd_intf_pins axi_iic_temp/IIC]
connect_bd_intf_net -intf_net axi_interconnect_0_M02_AXI [get_bd_intf_pins s_axi_divr] [get_bd_intf_pins axi_gpio_divr/S_AXI]
connect_bd_intf_net -intf_net axi_interconnect_0_M03_AXI [get_bd_intf_pins s_axi_reset] [get_bd_intf_pins axi_gpio_reset/S_AXI]
connect_bd_intf_net -intf_net axi_gpio_1_GPIO [get_bd_intf_pins dsp_reset] [get_bd_intf_pins axi_gpio_reset/GPIO]
connect_bd_intf_net -intf_net axi_quad_spi_0_SPI_0 [get_bd_intf_pins dsp_vadc_spi] [get_bd_intf_pins axi_quad_spi_vadc/SPI_0]
connect_bd_intf_net -intf_net axi_interconnect_0_M05_AXI [get_bd_intf_pins s_axi_vadc] [get_bd_intf_pins axi_quad_spi_vadc/AXI_LITE]
connect_bd_intf_net -intf_net link_rx_0_2 [get_bd_intf_pins link1_rx] [get_bd_intf_pins link_port_1/link_rx]
connect_bd_intf_net [get_bd_intf_pins link1_tx] [get_bd_intf_pins link_port_1/link_tx]
connect_bd_intf_net [get_bd_intf_pins dsp_bus_freq] [get_bd_intf_pins axi_gpio_bus_freq/GPIO]
connect_bd_intf_net [get_bd_intf_pins s_axi_bf] [get_bd_intf_pins axi_gpio_bus_freq/S_AXI]
connect_bd_intf_net [get_bd_intf_pins s_axi_cf] [get_bd_intf_pins axi_gpio_core_freq/S_AXI]
connect_bd_intf_net -intf_net link_rx_0_1 [get_bd_intf_pins link0_rx] [get_bd_intf_pins link_port_0/link_rx]
connect_bd_intf_net [get_bd_intf_pins link0_tx] [get_bd_intf_pins link_port_0/link_tx]
connect_bd_intf_net -intf_net axi_interconnect_0_M04_AXI [get_bd_intf_pins s_axi_temp] [get_bd_intf_pins axi_iic_temp/S_AXI]
connect_bd_intf_net [get_bd_intf_pins m_axis_link1] [get_bd_intf_pins link_port_1/M_AXIS]
connect_bd_intf_net [get_bd_intf_pins s_axis_link1] [get_bd_intf_pins link_port_1/S_AXIS]
connect_bd_intf_net [get_bd_intf_pins m_axis_link0] [get_bd_intf_pins link_port_0/M_AXIS]
connect_bd_net -net clk_wiz_0_clk_300M [get_bd_pins lxclk_ref] [get_bd_pins link_port_0/lxclk_ref] [get_bd_pins link_port_1/lxclk_ref]
connect_bd_net -net clk_wiz_0_clk_75M [get_bd_pins lxclk_ref_div4] [get_bd_pins link_port_0/lxclk_ref_div4] [get_bd_pins link_port_1/lxclk_ref_div4]
connect_bd_net -net clk_wiz_0_clk_200M [get_bd_pins delay_clk] [get_bd_pins link_port_0/delay_clk]
connect_bd_net -net microblaze_0_Clk [get_bd_pins s_axi_aclk] \
  [get_bd_pins axi_gpio_reset/s_axi_aclk] [get_bd_pins axi_gpio_divr/s_axi_aclk] [get_bd_pins axi_iic_temp/s_axi_aclk] \
  [get_bd_pins axi_quad_spi_vadc/s_axi_aclk] [get_bd_pins axi_quad_spi_vadc/ext_spi_clk] \
  [get_bd_pins axi_gpio_core_freq/s_axi_aclk] [get_bd_pins axi_gpio_bus_freq/s_axi_aclk] [get_bd_pins link_port_0/aclk] \
  [get_bd_pins link_port_1/aclk]
connect_bd_net -net mb_hier_peripheral_aresetn [get_bd_pins s_axi_aresetn] \
  [get_bd_pins axi_gpio_divr/s_axi_aresetn] [get_bd_pins axi_gpio_reset/s_axi_aresetn] \
  [get_bd_pins axi_iic_temp/s_axi_aresetn] [get_bd_pins axi_quad_spi_vadc/s_axi_aresetn] \
  [get_bd_pins axi_gpio_core_freq/s_axi_aresetn] [get_bd_pins axi_gpio_bus_freq/s_axi_aresetn] \
  [get_bd_pins link_port_0/aresetn] [get_bd_pins link_port_1/aresetn]
connect_bd_net -net clk_wiz_0_clk_300M90 [get_bd_pins lxclk_ref_90] [get_bd_pins link_port_0/lxclk_ref_90] [get_bd_pins link_port_1/lxclk_ref_90]
connect_bd_net -net axi_iic_1_iic2intc_irpt [get_bd_pins axi_iic_temp/iic2intc_irpt] [get_bd_pins iic2intc_irpt]
connect_bd_net -net axi_gpio_0_gpio_io_o [get_bd_pins axi_gpio_divr/gpio_io_o] [get_bd_pins dsp_pll_divr]
connect_bd_net -net axi_quad_spi_0_ip2intc_irpt [get_bd_pins axi_quad_spi_vadc/ip2intc_irpt] [get_bd_pins ip2intc_irpt]

current_bd_instance /tft_hier
connect_bd_intf_net -intf_net axi_quad_spi_1_SPI_0 [get_bd_intf_pins tft_spi] [get_bd_intf_pins axi_quad_spi/SPI_0]
connect_bd_intf_net -intf_net axi_interconnect_0_M06_AXI [get_bd_intf_pins s_axi_spi] [get_bd_intf_pins axi_quad_spi/AXI_LITE]
connect_bd_intf_net -intf_net axi_interconnect_0_M07_AXI [get_bd_intf_pins s_axi_gpio] [get_bd_intf_pins axi_gpio/S_AXI]
connect_bd_net -net clk_wiz_0_clk_10M [get_bd_pins ext_spi_clk] [get_bd_pins axi_quad_spi/ext_spi_clk]
connect_bd_net -net microblaze_0_Clk [get_bd_pins s_axi_aclk] [get_bd_pins axi_gpio/s_axi_aclk] [get_bd_pins axi_quad_spi/s_axi_aclk]
connect_bd_net -net mb_hier_peripheral_aresetn [get_bd_pins s_axi_aresetn] \
  [get_bd_pins axi_gpio/s_axi_aresetn] [get_bd_pins axi_quad_spi/s_axi_aresetn]
connect_bd_net -net axi_quad_spi_1_ip2intc_irpt [get_bd_pins axi_quad_spi/ip2intc_irpt] [get_bd_pins ip2intc_irpt]
connect_bd_net -net axi_gpio_2_ip2intc_irpt [get_bd_pins axi_gpio/ip2intc_irpt] [get_bd_pins ip2intc_irpt1]
connect_bd_net -net axi_gpio_2_gpio_io_o [get_bd_pins axi_gpio/gpio_io_o] [get_bd_pins tft_gpo]
connect_bd_net -net gpio2_io_i_0_1 [get_bd_pins tft_gpi] [get_bd_pins axi_gpio/gpio2_io_i]

current_bd_instance /udp_bridge_hier
connect_bd_intf_net [get_bd_intf_pins eth_udp_0/m_axis_mac] [get_bd_intf_pins eth_mac_0/s_axis_tx]
connect_bd_intf_net -intf_net ulb_0_m_axis_config [get_bd_intf_pins ulb_0/m_axis_udp_config] [get_bd_intf_pins eth_udp_0/s_axis_config]
connect_bd_intf_net [get_bd_intf_pins ulb_0/s_axis_udp] [get_bd_intf_pins eth_udp_0/m_axis_udp]
connect_bd_intf_net [get_bd_intf_pins ulb_0/m_axis_udp] [get_bd_intf_pins eth_udp_0/s_axis_udp]
connect_bd_intf_net [get_bd_intf_pins ulb_0/s_axis_udp_hdr] [get_bd_intf_pins eth_udp_0/m_axis_udp_hdr]
connect_bd_intf_net [get_bd_intf_pins ulb_0/m_axis_udp_hdr] [get_bd_intf_pins eth_udp_0/s_axis_udp_hdr]
connect_bd_intf_net [get_bd_intf_pins m_axis_link] [get_bd_intf_pins ulb_0/m_axis_link]
connect_bd_intf_net [get_bd_intf_pins eth_udp_0/s_axis_mac] [get_bd_intf_pins eth_mac_0/m_axis_rx]
connect_bd_intf_net [get_bd_intf_pins rgmii] [get_bd_intf_pins eth_mac_0/rgmii]
connect_bd_intf_net [get_bd_intf_pins s_axis_link] [get_bd_intf_pins ulb_0/s_axis_link]
connect_bd_net [get_bd_pins clk_wiz_1/clk_125M] \
  [get_bd_pins proc_sys_reset_0/slowest_sync_clk] [get_bd_pins eth_mac_0/aclk] [get_bd_pins eth_mac_0/gtx_clk] \
  [get_bd_pins eth_udp_0/aclk] [get_bd_pins ulb_0/axis_udp_aclk]
connect_bd_net [get_bd_pins clk_wiz_1/clk_125M90] [get_bd_pins eth_mac_0/gtx_clk90]
connect_bd_net [get_bd_pins clk_wiz_1/clk_200M] [get_bd_pins eth_mac_0/delay_clk]
connect_bd_net [get_bd_pins clk_wiz_1/locked] [get_bd_pins proc_sys_reset_0/dcm_locked]
connect_bd_net [get_bd_pins proc_sys_reset_0/peripheral_aresetn] \
  [get_bd_pins eth_mac_0/aresetn] [get_bd_pins eth_udp_0/aresetn] [get_bd_pins ulb_0/axis_udp_aresetn]
connect_bd_net [get_bd_pins xlconstant_0/dout] [get_bd_pins proc_sys_reset_0/ext_reset_in]
connect_bd_net [get_bd_pins proc_sys_reset_0/peripheral_reset] [get_bd_pins eth_mac_0/gtx_rst]
connect_bd_net -net microblaze_0_Clk [get_bd_pins aclk] [get_bd_pins clk_wiz_1/clk_in1] [get_bd_pins ulb_0/axis_link_aclk]
connect_bd_net [get_bd_pins eth_mac_0/mdc] [get_bd_pins mdc]
connect_bd_net [get_bd_pins eth_mac_0/mdio] [get_bd_pins mdio]
connect_bd_net [get_bd_pins eth_mac_0/phy_rst] [get_bd_pins phy_rst]
connect_bd_net [get_bd_pins aresetn] [get_bd_pins ulb_0/axis_link_aresetn]

current_bd_instance /audio_hier
connect_bd_intf_net -intf_net axi_interconnect_0_M11_AXI [get_bd_intf_pins s_axi_i2s_tx] [get_bd_intf_pins i2s_transmitter_0/s_axi_ctrl]
connect_bd_intf_net -intf_net axi_quad_spi_0_SPI_1 [get_bd_intf_pins audio_spi] [get_bd_intf_pins axi_quad_spi_audio/SPI_0]
connect_bd_intf_net [get_bd_intf_pins i2s_receiver_0/m_axis_aud] [get_bd_intf_pins i2s_transmitter_0/s_axis_aud]
connect_bd_intf_net -intf_net axi_interconnect_0_M14_AXI [get_bd_intf_pins s_axi_ctrl] [get_bd_intf_pins axi_quad_spi_audio/AXI_LITE]
connect_bd_intf_net -intf_net axi_interconnect_0_M12_AXI [get_bd_intf_pins s_axi_i2s_rx] [get_bd_intf_pins i2s_receiver_0/s_axi_ctrl]
connect_bd_net [get_bd_pins clk_wiz_2/locked] [get_bd_pins proc_sys_reset_1/dcm_locked]
connect_bd_net [get_bd_pins clk_wiz_2/clk_12M] \
  [get_bd_pins proc_sys_reset_1/slowest_sync_clk] [get_bd_pins i2s_receiver_0/aud_mclk] \
  [get_bd_pins i2s_transmitter_0/aud_mclk] [get_bd_pins axi_quad_spi_audio/ext_spi_clk]
connect_bd_net [get_bd_pins xlconstant_1/dout] [get_bd_pins proc_sys_reset_1/ext_reset_in]
connect_bd_net [get_bd_pins proc_sys_reset_1/peripheral_reset] [get_bd_pins i2s_receiver_0/aud_mrst] [get_bd_pins i2s_transmitter_0/aud_mrst]
connect_bd_net -net microblaze_0_Clk [get_bd_pins aclk] \
  [get_bd_pins i2s_transmitter_0/s_axi_ctrl_aclk] [get_bd_pins i2s_receiver_0/s_axi_ctrl_aclk] \
  [get_bd_pins axi_quad_spi_audio/s_axi_aclk] [get_bd_pins i2s_receiver_0/m_axis_aud_aclk] \
  [get_bd_pins i2s_transmitter_0/s_axis_aud_aclk] [get_bd_pins clk_wiz_2/clk_in1]
connect_bd_net -net mb_hier_peripheral_aresetn [get_bd_pins aresetn] \
  [get_bd_pins i2s_transmitter_0/s_axi_ctrl_aresetn] [get_bd_pins axi_quad_spi_audio/s_axi_aresetn] \
  [get_bd_pins i2s_receiver_0/m_axis_aud_aresetn] [get_bd_pins i2s_transmitter_0/s_axis_aud_aresetn] \
  [get_bd_pins i2s_receiver_0/s_axi_ctrl_aresetn]
connect_bd_net [get_bd_pins i2s_receiver_0/lrclk_out] [get_bd_pins audio_i2s_lrcin]
connect_bd_net -net sdata_0_in_0_1 [get_bd_pins audio_i2s_din] [get_bd_pins i2s_receiver_0/sdata_0_in]
connect_bd_net [get_bd_pins i2s_transmitter_0/lrclk_out] [get_bd_pins audio_i2s_lrcout]
connect_bd_net [get_bd_pins i2s_transmitter_0/sclk_out] [get_bd_pins audio_i2s_bclk]
connect_bd_net [get_bd_pins i2s_transmitter_0/sdata_0_out] [get_bd_pins audio_i2s_dout]
connect_bd_net -net axi_quad_spi_0_ip2intc_irpt1 [get_bd_pins axi_quad_spi_audio/ip2intc_irpt] [get_bd_pins ip2intc_irpt]

current_bd_instance /
connect_bd_intf_net [get_bd_intf_pins dsp_hier/s_axi_reset] [get_bd_intf_pins axi_interconnect_0/M03_AXI]
connect_bd_intf_net [get_bd_intf_pins axi_interconnect_0/M06_AXI] [get_bd_intf_pins tft_hier/s_axi_spi]
connect_bd_intf_net -intf_net microblaze_0_M_AXI_DC [get_bd_intf_pins mb_hier/M_AXI_DC] [get_bd_intf_pins ddr3_hier/S_AXI]
connect_bd_intf_net -intf_net link_rx_0_2 [get_bd_intf_ports link1_rx] [get_bd_intf_pins dsp_hier/link1_rx]
connect_bd_intf_net [get_bd_intf_pins dsp_hier/s_axi_divr] [get_bd_intf_pins axi_interconnect_0/M02_AXI]
connect_bd_intf_net [get_bd_intf_pins axi_interconnect_0/S00_AXI] [get_bd_intf_pins mb_hier/M_AXI_PERIPH]
connect_bd_intf_net -intf_net axi_iic_0_IIC [get_bd_intf_ports gpio] [get_bd_intf_pins axi_iic_gpio/IIC]
connect_bd_intf_net -intf_net axi_gpio_1_GPIO [get_bd_intf_ports dsp_reset] [get_bd_intf_pins dsp_hier/dsp_reset]
connect_bd_intf_net -intf_net axi_quad_spi_1_SPI_0 [get_bd_intf_ports tft_spi] [get_bd_intf_pins tft_hier/tft_spi]
connect_bd_intf_net -intf_net link_port_0_link_tx [get_bd_intf_ports link0_tx] [get_bd_intf_pins dsp_hier/link0_tx]
connect_bd_intf_net -intf_net axi_quad_spi_0_SPI_1 [get_bd_intf_ports audio_spi] [get_bd_intf_pins audio_hier/audio_spi]
connect_bd_intf_net [get_bd_intf_pins axi_interconnect_0/M12_AXI] [get_bd_intf_pins audio_hier/s_axi_i2s_rx]
connect_bd_intf_net [get_bd_intf_pins axi_interconnect_0/M14_AXI] [get_bd_intf_pins audio_hier/s_axi_ctrl]
connect_bd_intf_net [get_bd_intf_pins axi_interconnect_0/M11_AXI] [get_bd_intf_pins audio_hier/s_axi_i2s_tx]
connect_bd_intf_net [get_bd_intf_pins dsp_hier/m_axis_link1] [get_bd_intf_pins dsp_hier/s_axis_link1]
connect_bd_intf_net [get_bd_intf_pins udp_bridge_hier/m_axis_link] [get_bd_intf_pins dsp_hier/s_axis_link0]
connect_bd_intf_net -intf_net mig_7series_0_DDR3 [get_bd_intf_ports DDR3] [get_bd_intf_pins ddr3_hier/DDR3]
connect_bd_intf_net [get_bd_intf_pins udp_bridge_hier/s_axis_link] [get_bd_intf_pins dsp_hier/m_axis_link0]
connect_bd_intf_net [get_bd_intf_pins axi_interconnect_0/M00_AXI] [get_bd_intf_pins nb3n502_0/S_AXI]
connect_bd_intf_net -intf_net link_port_1_link_tx [get_bd_intf_ports link1_tx] [get_bd_intf_pins dsp_hier/link1_tx]
connect_bd_intf_net [get_bd_intf_pins axi_interconnect_0/M04_AXI] [get_bd_intf_pins dsp_hier/s_axi_temp]
connect_bd_intf_net [get_bd_intf_pins axi_interconnect_0/M05_AXI] [get_bd_intf_pins dsp_hier/s_axi_vadc]
connect_bd_intf_net [get_bd_intf_pins axi_interconnect_0/M07_AXI] [get_bd_intf_pins tft_hier/s_axi_gpio]
connect_bd_intf_net [get_bd_intf_pins axi_iic_gpio/S_AXI] [get_bd_intf_pins axi_interconnect_0/M01_AXI]
connect_bd_intf_net -intf_net axi_iic_1_IIC [get_bd_intf_ports dsp_temp] [get_bd_intf_pins dsp_hier/dsp_temp]
connect_bd_intf_net -intf_net axi_quad_spi_0_SPI_0 [get_bd_intf_ports dsp_vadc_spi] [get_bd_intf_pins dsp_hier/dsp_vadc_spi]
connect_bd_intf_net [get_bd_intf_pins axi_interconnect_0/M08_AXI] [get_bd_intf_pins axi_gpio_led/S_AXI]
connect_bd_intf_net -intf_net dsp_hier_GPIO_1 [get_bd_intf_ports dsp_bus_freq] [get_bd_intf_pins dsp_hier/dsp_bus_freq]
connect_bd_intf_net [get_bd_intf_pins axi_interconnect_0/M10_AXI] [get_bd_intf_pins dsp_hier/s_axi_bf]
connect_bd_intf_net [get_bd_intf_pins axi_interconnect_0/M09_AXI] [get_bd_intf_pins dsp_hier/s_axi_cf]
connect_bd_intf_net -intf_net dsp_hier_GPIO_0 [get_bd_intf_ports dsp_core_freq] [get_bd_intf_pins dsp_hier/dsp_core_freq]
connect_bd_intf_net -intf_net link_rx_0_1 [get_bd_intf_ports link0_rx] [get_bd_intf_pins dsp_hier/link0_rx]
connect_bd_intf_net -intf_net eth_mac_0_rgmii [get_bd_intf_ports rgmii] [get_bd_intf_pins udp_bridge_hier/rgmii]
connect_bd_net -net microblaze_0_Clk [get_bd_pins clk_wiz_0/clk_100M] \
  [get_bd_pins ddr3_hier/s_axi_aclk] [get_bd_pins mb_hier/clk] [get_bd_pins axi_interconnect_0/ACLK] \
  [get_bd_pins axi_interconnect_0/S00_ACLK] [get_bd_pins axi_interconnect_0/M00_ACLK] \
  [get_bd_pins axi_interconnect_0/M01_ACLK] [get_bd_pins axi_iic_gpio/s_axi_aclk] [get_bd_pins axi_interconnect_0/M02_ACLK] \
  [get_bd_pins axi_interconnect_0/M03_ACLK] [get_bd_pins axi_interconnect_0/M04_ACLK] \
  [get_bd_pins axi_interconnect_0/M05_ACLK] [get_bd_pins axi_interconnect_0/M06_ACLK] \
  [get_bd_pins axi_interconnect_0/M07_ACLK] [get_bd_pins axi_gpio_led/s_axi_aclk] [get_bd_pins axi_interconnect_0/M08_ACLK] \
  [get_bd_pins dsp_hier/s_axi_aclk] [get_bd_pins tft_hier/s_axi_aclk] [get_bd_pins axi_interconnect_0/M09_ACLK] \
  [get_bd_pins axi_interconnect_0/M10_ACLK] [get_bd_pins axi_interconnect_0/M11_ACLK] \
  [get_bd_pins axi_interconnect_0/M12_ACLK] [get_bd_pins axi_interconnect_0/M13_ACLK] \
  [get_bd_pins axi_interconnect_0/M14_ACLK] [get_bd_pins udp_bridge_hier/aclk] [get_bd_pins audio_hier/aclk] \
  [get_bd_pins nb3n502_0/s_axi_aclk]
connect_bd_net [get_bd_pins clk_wiz_0/clk_200M] [get_bd_pins ddr3_hier/clk_ref_i] [get_bd_pins dsp_hier/delay_clk]
connect_bd_net [get_bd_pins gt_clock_0/clkout] [get_bd_pins clk_wiz_0/clk_in1]
connect_bd_net -net gt_clk_p_0_1 [get_bd_ports sys_clk_p] [get_bd_pins gt_clock_0/gt_clk_p]
connect_bd_net -net gt_clk_n_0_1 [get_bd_ports sys_clk_n] [get_bd_pins gt_clock_0/gt_clk_n]
connect_bd_net -net xlconstant_0_dout [get_bd_pins clk_config_hier/clk_gen1_ss] [get_bd_ports clk_gen1_ss]
connect_bd_net -net xlconstant_1_dout [get_bd_pins clk_config_hier/clk_gen0_sclk] [get_bd_ports clk_gen0_sclk]
connect_bd_net [get_bd_pins clk_wiz_0/locked] [get_bd_pins mb_hier/dcm_locked]
connect_bd_net -net interconnect_aresetn [get_bd_pins mb_hier/interconnect_aresetn] \
  [get_bd_pins ddr3_hier/interconnect_aresetn] [get_bd_pins axi_interconnect_0/ARESETN]
connect_bd_net -net xlconstant_2_dout [get_bd_pins clk_config_hier/clk_gen0_ss] [get_bd_ports clk_gen0_ss]
connect_bd_net -net xlconstant_3_dout [get_bd_pins clk_config_hier/clk_gen0_oe] [get_bd_ports clk_gen0_oe]
connect_bd_net -net xlconstant_4_dout [get_bd_pins clk_config_hier/clk_gen1_oe] [get_bd_ports clk_gen1_oe]
connect_bd_net -net xlconstant_5_dout [get_bd_pins clk_config_hier/clk_gen1_sclk] [get_bd_ports clk_gen1_sclk]
connect_bd_net -net xlconstant_6_dout [get_bd_pins clk_config_hier/rdr_scl] [get_bd_ports rdr_scl]
connect_bd_net [get_bd_pins mb_hier/peripheral_aresetn] \
  [get_bd_pins axi_interconnect_0/S00_ARESETN] [get_bd_pins axi_interconnect_0/M00_ARESETN] \
  [get_bd_pins axi_interconnect_0/M01_ARESETN] [get_bd_pins axi_iic_gpio/s_axi_aresetn] \
  [get_bd_pins axi_interconnect_0/M02_ARESETN] [get_bd_pins axi_interconnect_0/M03_ARESETN] \
  [get_bd_pins axi_interconnect_0/M04_ARESETN] [get_bd_pins axi_interconnect_0/M05_ARESETN] \
  [get_bd_pins axi_interconnect_0/M06_ARESETN] [get_bd_pins axi_interconnect_0/M07_ARESETN] \
  [get_bd_pins axi_gpio_led/s_axi_aresetn] [get_bd_pins axi_interconnect_0/M08_ARESETN] [get_bd_pins dsp_hier/s_axi_aresetn] \
  [get_bd_pins tft_hier/s_axi_aresetn] [get_bd_pins axi_interconnect_0/M09_ARESETN] \
  [get_bd_pins axi_interconnect_0/M10_ARESETN] [get_bd_pins axi_interconnect_0/M11_ARESETN] \
  [get_bd_pins axi_interconnect_0/M12_ARESETN] [get_bd_pins axi_interconnect_0/M13_ARESETN] \
  [get_bd_pins axi_interconnect_0/M14_ARESETN] [get_bd_pins ddr3_hier/peripheral_aresetn] [get_bd_pins audio_hier/aresetn] \
  [get_bd_pins udp_bridge_hier/aresetn] [get_bd_pins nb3n502_0/s_axi_aresetn]
connect_bd_net [get_bd_ports bus_freq_div] [get_bd_pins nb3n502_0/s]
connect_bd_net -net axi_iic_0_iic2intc_irpt [get_bd_pins axi_iic_gpio/iic2intc_irpt] [get_bd_pins xlconcat_0/In0]
connect_bd_net [get_bd_pins xlconcat_0/dout] [get_bd_pins mb_hier/irq]
connect_bd_net -net axi_gpio_0_gpio_io_o [get_bd_pins dsp_hier/dsp_pll_divr] [get_bd_ports dsp_pll_divr]
connect_bd_net [get_bd_pins util_vector_logic_0/Res] [get_bd_pins util_vector_logic_1/Op1]
connect_bd_net -net Op1_0_1 [get_bd_ports uart_rx] [get_bd_pins util_vector_logic_0/Op1]
connect_bd_net [get_bd_pins util_vector_logic_1/Res] [get_bd_ports uart_tx]
connect_bd_net -net axi_iic_1_iic2intc_irpt [get_bd_pins dsp_hier/iic2intc_irpt] [get_bd_pins xlconcat_0/In1]
connect_bd_net -net axi_quad_spi_0_ip2intc_irpt [get_bd_pins dsp_hier/ip2intc_irpt] [get_bd_pins xlconcat_0/In2]
connect_bd_net -net axi_quad_spi_1_ip2intc_irpt [get_bd_pins tft_hier/ip2intc_irpt] [get_bd_pins xlconcat_0/In3]
connect_bd_net -net axi_gpio_2_ip2intc_irpt [get_bd_pins tft_hier/ip2intc_irpt1] [get_bd_pins xlconcat_0/In4]
connect_bd_net -net gpio2_io_i_0_1 [get_bd_ports tft_gpi] [get_bd_pins tft_hier/tft_gpi]
connect_bd_net -net axi_gpio_2_gpio_io_o [get_bd_pins tft_hier/tft_gpo] [get_bd_ports tft_gpo]
connect_bd_net -net axi_gpio_3_gpio_io_o [get_bd_pins axi_gpio_led/gpio_io_o] [get_bd_ports led_fast]
connect_bd_net [get_bd_pins clk_wiz_0/clk_10M] [get_bd_pins tft_hier/ext_spi_clk]
connect_bd_net [get_bd_pins clk_wiz_0/clk_300M90] [get_bd_pins dsp_hier/lxclk_ref_90]
connect_bd_net [get_bd_pins clk_wiz_0/clk_75M] [get_bd_pins dsp_hier/lxclk_ref_div4]
connect_bd_net [get_bd_pins clk_wiz_0/clk_300M] [get_bd_pins dsp_hier/lxclk_ref]
connect_bd_net -net eth_mac_0_mdc [get_bd_pins udp_bridge_hier/mdc] [get_bd_ports mdc]
connect_bd_net -net eth_mac_0_mdio [get_bd_pins udp_bridge_hier/mdio] [get_bd_ports mdio]
connect_bd_net -net eth_mac_0_phy_rst [get_bd_pins udp_bridge_hier/phy_rst] [get_bd_ports phy_rst]
connect_bd_net -net axi_quad_spi_0_ip2intc_irpt1 [get_bd_pins audio_hier/ip2intc_irpt] [get_bd_pins xlconcat_0/In5]
connect_bd_net [get_bd_pins audio_hier/audio_i2s_lrcin] [get_bd_ports audio_i2s_lrcin]
connect_bd_net [get_bd_pins audio_hier/audio_i2s_lrcout] [get_bd_ports audio_i2s_lrcout]
connect_bd_net [get_bd_pins audio_hier/audio_i2s_bclk] [get_bd_ports audio_i2s_bclk]
connect_bd_net [get_bd_pins audio_hier/audio_i2s_dout] [get_bd_ports audio_i2s_dout]
connect_bd_net -net audio_i2s_din_0_1 [get_bd_ports audio_i2s_din] [get_bd_pins audio_hier/audio_i2s_din]

# ---- address map ----
assign_bd_address -offset 0x00000000 -range 256K -target_address_space [get_bd_addr_spaces mb_hier/microblaze_0/Data] [get_bd_addr_segs mb_hier/microblaze_0_local_memory/dlmb_bram_if_cntlr/SLMB/Mem]
assign_bd_address -offset 0x40000000 -range 64K -target_address_space [get_bd_addr_spaces mb_hier/microblaze_0/Data] [get_bd_addr_segs dsp_hier/axi_gpio_divr/S_AXI/Reg]
assign_bd_address -offset 0x40010000 -range 64K -target_address_space [get_bd_addr_spaces mb_hier/microblaze_0/Data] [get_bd_addr_segs dsp_hier/axi_gpio_reset/S_AXI/Reg]
assign_bd_address -offset 0x40020000 -range 64K -target_address_space [get_bd_addr_spaces mb_hier/microblaze_0/Data] [get_bd_addr_segs tft_hier/axi_gpio/S_AXI/Reg]
assign_bd_address -offset 0x40030000 -range 64K -target_address_space [get_bd_addr_spaces mb_hier/microblaze_0/Data] [get_bd_addr_segs axi_gpio_led/S_AXI/Reg]
assign_bd_address -offset 0x40040000 -range 64K -target_address_space [get_bd_addr_spaces mb_hier/microblaze_0/Data] [get_bd_addr_segs dsp_hier/axi_gpio_core_freq/S_AXI/Reg]
assign_bd_address -offset 0x40050000 -range 64K -target_address_space [get_bd_addr_spaces mb_hier/microblaze_0/Data] [get_bd_addr_segs dsp_hier/axi_gpio_bus_freq/S_AXI/Reg]
assign_bd_address -offset 0x40800000 -range 64K -target_address_space [get_bd_addr_spaces mb_hier/microblaze_0/Data] [get_bd_addr_segs axi_iic_gpio/S_AXI/Reg]
assign_bd_address -offset 0x40810000 -range 64K -target_address_space [get_bd_addr_spaces mb_hier/microblaze_0/Data] [get_bd_addr_segs dsp_hier/axi_iic_temp/S_AXI/Reg]
assign_bd_address -offset 0x41200000 -range 64K -target_address_space [get_bd_addr_spaces mb_hier/microblaze_0/Data] [get_bd_addr_segs mb_hier/microblaze_0_axi_intc/S_AXI/Reg]
assign_bd_address -offset 0x41400000 -range 4K -target_address_space [get_bd_addr_spaces mb_hier/microblaze_0/Data] [get_bd_addr_segs mb_hier/mdm_1/S_AXI/Reg]
assign_bd_address -offset 0x41C00000 -range 64K -target_address_space [get_bd_addr_spaces mb_hier/microblaze_0/Data] [get_bd_addr_segs mb_hier/axi_timer_0/S_AXI/Reg]
assign_bd_address -offset 0x44A00000 -range 64K -target_address_space [get_bd_addr_spaces mb_hier/microblaze_0/Data] [get_bd_addr_segs nb3n502_0/S_AXI/S_AXI_reg]
assign_bd_address -offset 0x44A10000 -range 64K -target_address_space [get_bd_addr_spaces mb_hier/microblaze_0/Data] [get_bd_addr_segs dsp_hier/axi_quad_spi_vadc/AXI_LITE/Reg]
assign_bd_address -offset 0x44A20000 -range 64K -target_address_space [get_bd_addr_spaces mb_hier/microblaze_0/Data] [get_bd_addr_segs tft_hier/axi_quad_spi/AXI_LITE/Reg]
assign_bd_address -offset 0x44A30000 -range 64K -target_address_space [get_bd_addr_spaces mb_hier/microblaze_0/Data] [get_bd_addr_segs audio_hier/i2s_transmitter_0/s_axi_ctrl/Reg]
assign_bd_address -offset 0x44A40000 -range 64K -target_address_space [get_bd_addr_spaces mb_hier/microblaze_0/Data] [get_bd_addr_segs audio_hier/i2s_receiver_0/s_axi_ctrl/Reg]
assign_bd_address -offset 0x44A60000 -range 64K -target_address_space [get_bd_addr_spaces mb_hier/microblaze_0/Data] [get_bd_addr_segs audio_hier/axi_quad_spi_audio/AXI_LITE/Reg]
assign_bd_address -offset 0x80000000 -range 512M -target_address_space [get_bd_addr_spaces mb_hier/microblaze_0/Data] [get_bd_addr_segs ddr3_hier/mig_7series_0/memmap/memaddr]
assign_bd_address -offset 0x00000000 -range 256K -target_address_space [get_bd_addr_spaces mb_hier/microblaze_0/Instruction] [get_bd_addr_segs mb_hier/microblaze_0_local_memory/ilmb_bram_if_cntlr/SLMB/Mem]

validate_bd_design
save_bd_design
